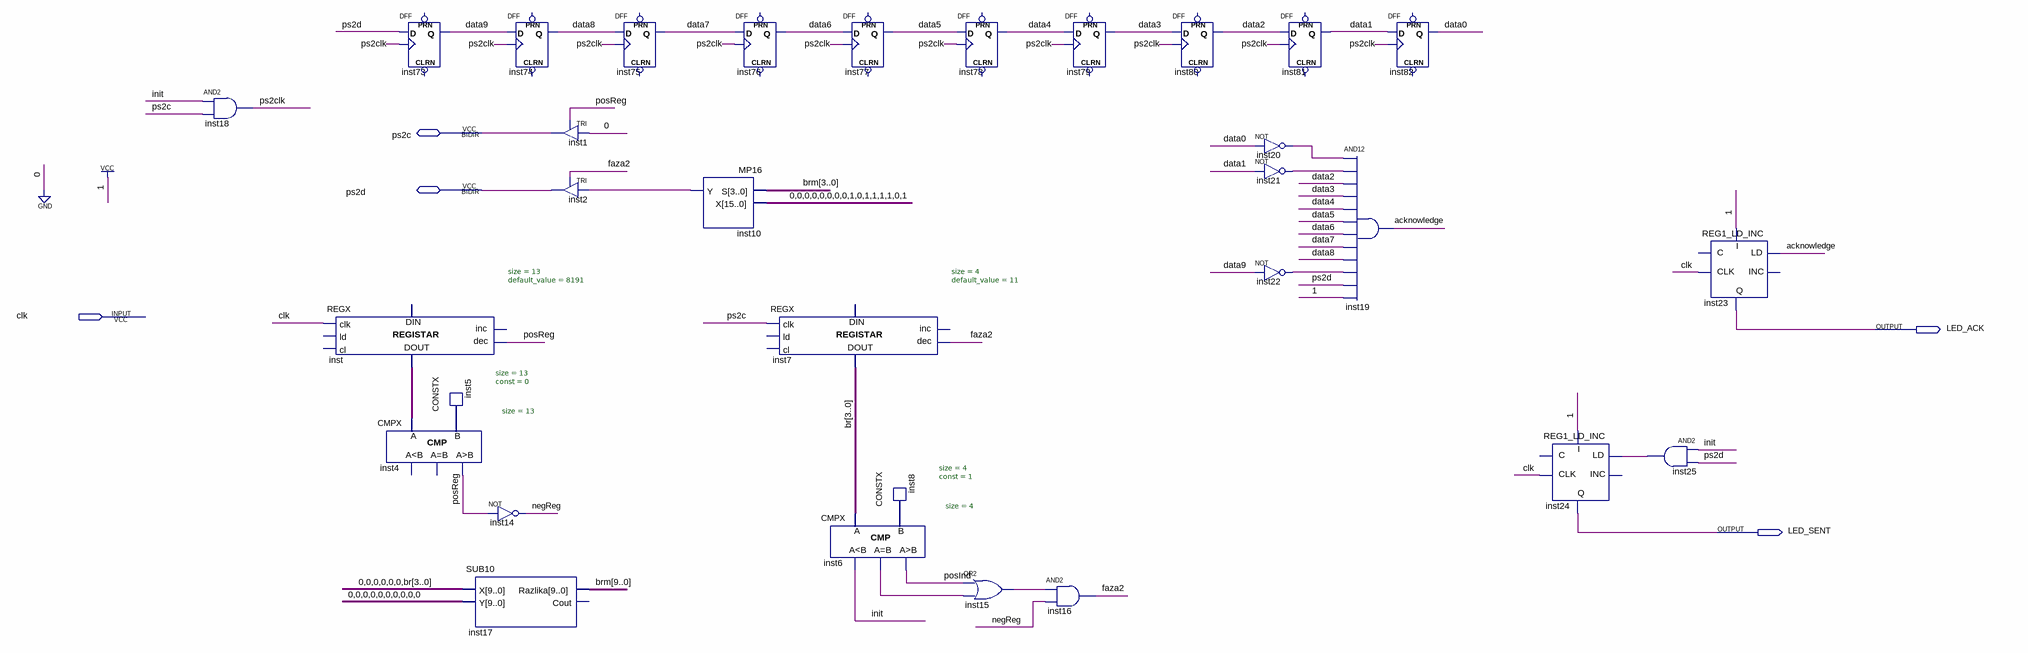
[diagram p0: schematic sheet]
// Quartus schematic MouseSetup.bdf as structural Verilog: 31 symbols, 5 pins
module MouseSetup (
  input  clk,
  inout  ps2c,
  inout  ps2d,
  output LED_ACK,
  output LED_SENT
);

  wire acknowledge, data0, data1, data2, data3, data4, data5, data6, data7, data8, data9, faza2, init,
       inst6_eq, inst10_y, inst15_out, inst20_out, inst21_out, inst22_out, inst25_out, negReg, posInd,
       posReg, ps2clk;
  wire [3:0] br, inst8_data;
  wire [9:0] brm;
  wire [12:0] inst5_data, inst_data_out;

  and inst18 (ps2clk, init, ps2c);
  REGX #(.size(13), .default_value(8191)) inst (
    .clk(clk), .dec(posReg), .data_out(inst_data_out));  // open: ld, cl, inc, data_in
  CMPX #(.size(13)) inst4 (.A(inst_data_out), .B(inst5_data), .gr(posReg));  // open: ls, eq
  DFF inst73 (.CLK(ps2clk), .D(ps2d), .Q(data9));  // open: CLRN, PRN
  CONSTX #(.size(13), .\const (0)) inst5 (.data(inst5_data));
  SUB10 inst17 (.X({{6{1'b0}}, br}), .Y({10{1'b0}}), .Razlika(brm));  // open: Cout
  DFF inst74 (.CLK(ps2clk), .D(data9), .Q(data8));  // open: CLRN, PRN
  not inst14 (negReg, posReg);
  TRI inst1 (.IN(1'b0), .OE(posReg), .OUT(ps2c));
  TRI inst2 (.IN(inst10_y), .OE(faza2), .OUT(ps2d));
  DFF inst75 (.CLK(ps2clk), .D(data8), .Q(data7));  // open: CLRN, PRN
  MP16 inst10 (.S(brm[3:0]), .X(16'b0000000010111101), .Y(inst10_y));
  DFF inst76 (.CLK(ps2clk), .D(data7), .Q(data6));  // open: CLRN, PRN
  REGX #(.size(4), .default_value(11)) inst7 (.clk(ps2c), .dec(faza2), .data_out(br));  // open: ld, cl, inc, data_in
  CMPX #(.size(4)) inst6 (.A(br), .B(inst8_data), .ls(init), .eq(inst6_eq), .gr(posInd));
  DFF inst77 (.CLK(ps2clk), .D(data6), .Q(data5));  // open: CLRN, PRN
  CONSTX #(.size(4), .\const (1)) inst8 (.data(inst8_data));
  DFF inst78 (.CLK(ps2clk), .D(data5), .Q(data4));  // open: CLRN, PRN
  or inst15 (inst15_out, posInd, inst6_eq);
  DFF inst79 (.CLK(ps2clk), .D(data4), .Q(data3));  // open: CLRN, PRN
  and inst16 (faza2, inst15_out, negReg);
  DFF inst80 (.CLK(ps2clk), .D(data3), .Q(data2));  // open: CLRN, PRN
  DFF inst81 (.CLK(ps2clk), .D(data2), .Q(data1));  // open: CLRN, PRN
  not inst20 (inst20_out, data0);
  not inst21 (inst21_out, data1);
  not inst22 (inst22_out, data9);
  DFF inst82 (.CLK(ps2clk), .D(data1), .Q(data0));  // open: CLRN, PRN
  and inst19 (acknowledge, inst20_out, inst21_out, data2, data3, data4, data5, data6, data7, data8, inst22_out, ps2d, 1'b1);
  REG1_LD_INC inst24 (.I(1'b1), .LD(inst25_out), .CLK(clk), .Q(LED_SENT));  // open: INC, C
  and inst25 (inst25_out, init, ps2d);
  REG1_LD_INC inst23 (.I(1'b1), .LD(acknowledge), .CLK(clk), .Q(LED_ACK));  // open: INC, C
endmodule
